# EAGLE design Serial LCD Backpack v28 (EAGLE 5.04)
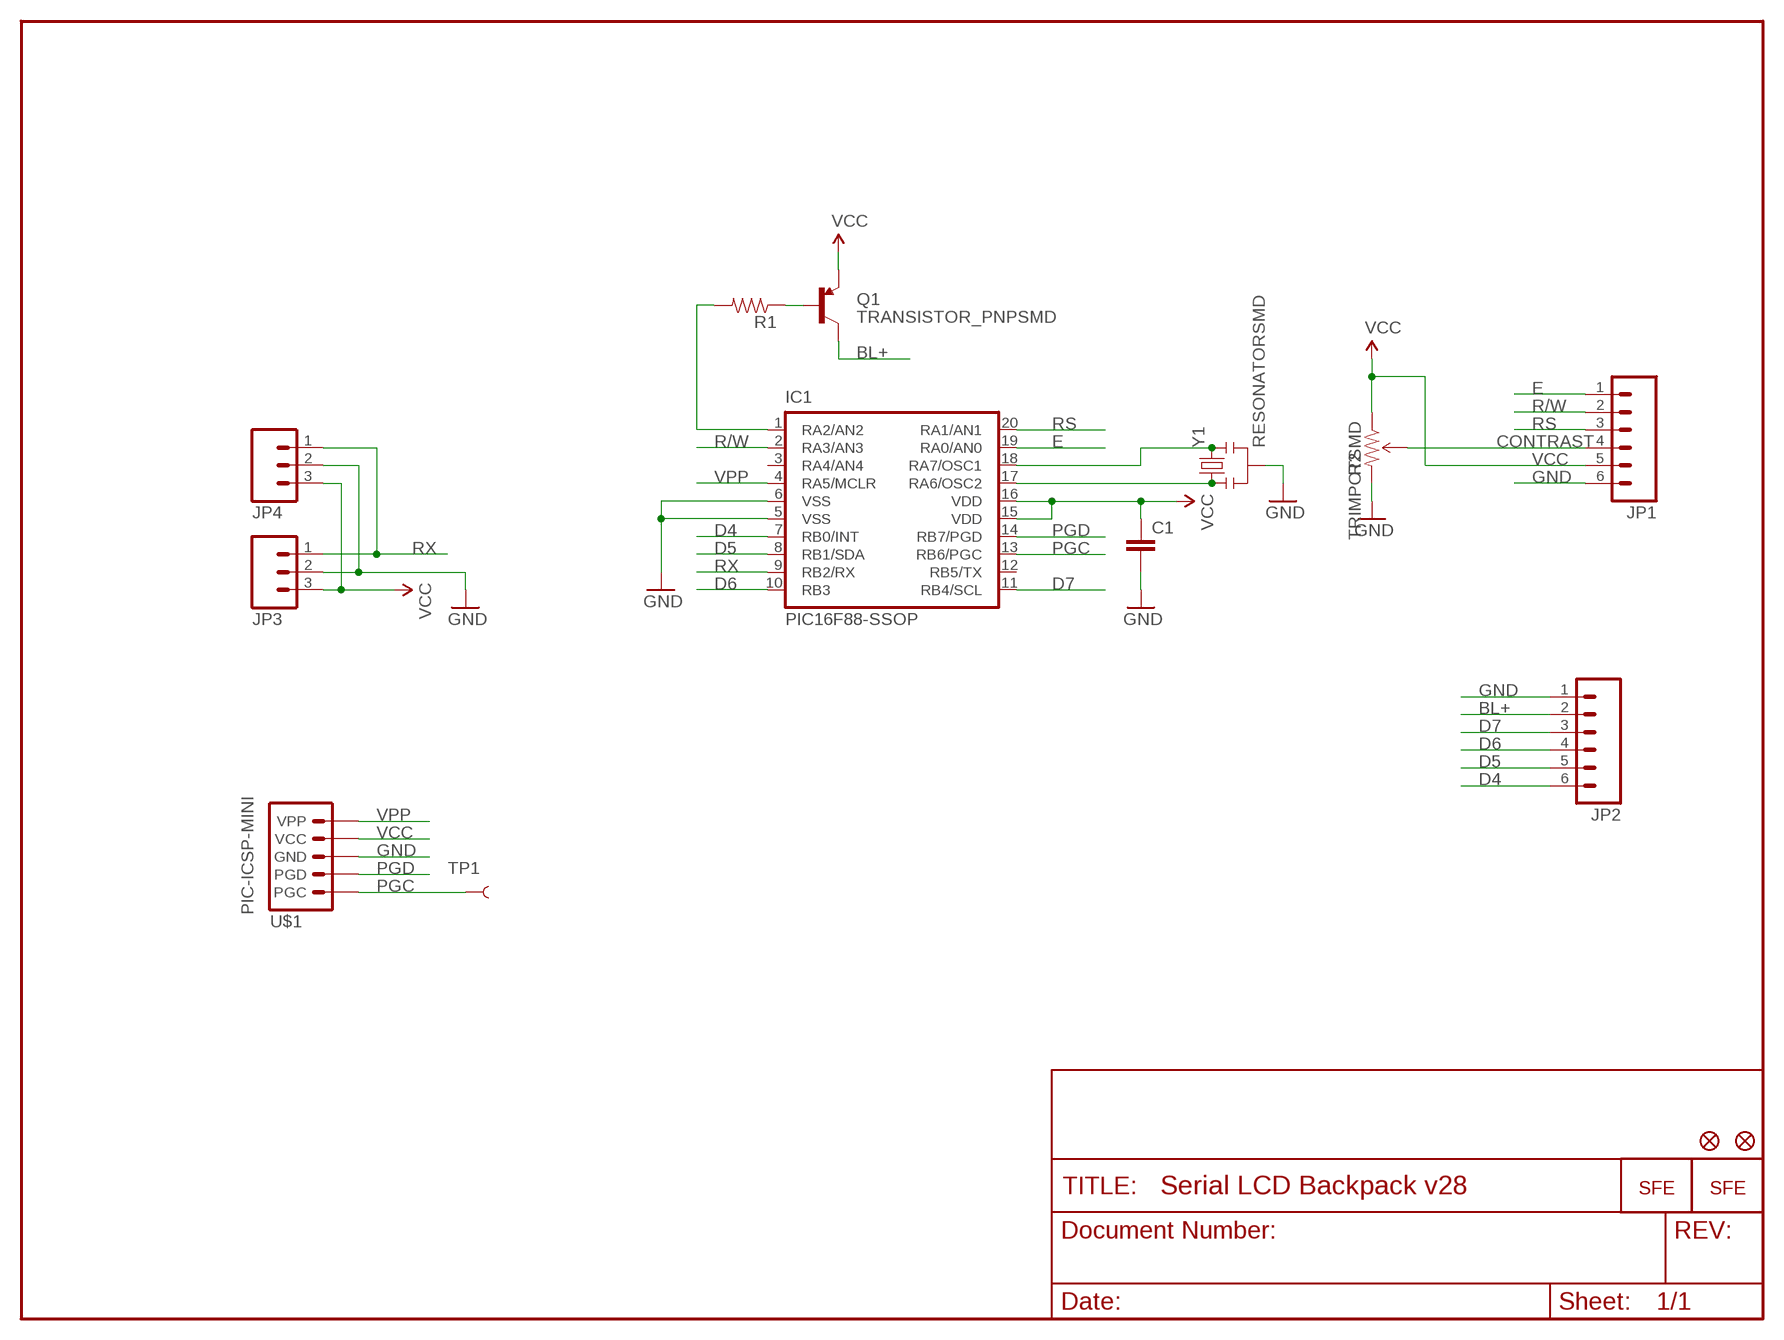
[diagram p0: schematic, sheet 1]

## Parts
C1  CAP0402-CAP  [0402-CAP]
IC1  PIC16F88-SSOP  [SSOP20]
JP1  M06LOCK  [1X06_LOCK]
JP2  M06LOCK  [1X06_LOCK]
JP3  M03PTH  [1X03]
JP4  M03SCREW_LOCK  [SCREWTERMINAL-3.5MM-3_LOCK.007S]
Q1  TRANSISTOR_PNPSMD  [SOT23-3]
R1  RESISTOR0402-RES  [0402-RES]
R2  TRIMPOTSMD  [TRIMPOT-3MM]
TP1  TEST-POINT3X5  [PAD.03X.05]
U$1  PIC-ICSP-MINI  [PIC-ICSP-MINI]
U$2  LOGO-FLAME-LARGE  [LOGO-FLAME-LARGE]
U$3  FIDUCIAL1X2  [FIDUCIAL-1X2]
U$4  FIDUCIAL1X2  [FIDUCIAL-1X2]
U$5  LOGO-SFENEW  [SFE-NEW-WEBLOGO]
Y1  RESONATORSMD  [RESONATOR-SMD]

## Nets
BL+: JP2.2 Q1.3(C)
CONTRAST: JP1.4 R2.2(WIPER)
D4: IC1.7(RB0/INT) JP2.6
D5: IC1.8(RB1/SDA) JP2.5
D6: IC1.10(RB3) JP2.4
D7: IC1.11(RB4/SCL) JP2.3
E: IC1.19(RA0/AN0) JP1.1
GND: C1.2 IC1.5(VSS) IC1.6(VSS) JP1.6 JP2.1 JP3.2 JP4.2 R2.3(CW) U$1.3(GND) Y1.2
N$3: IC1.18(RA7/OSC1) Y1.3
N$4: IC1.17(RA6/OSC2) Y1.1
N$11: IC1.1(RA2/AN2) R1.2
N$13: Q1.1(B) R1.1
PGC: IC1.13(RB6/PGC) TP1.P$1 U$1.5(PGC)
PGD: IC1.14(RB7/PGD) U$1.4(PGD)
R/W: IC1.2(RA3/AN3) JP1.2
RS: IC1.20(RA1/AN1) JP1.3
RX: IC1.9(RB2/RX) JP3.1 JP4.1
VCC: C1.1 IC1.15(VDD) IC1.16(VDD) JP1.5 JP3.3 JP4.3 Q1.2(E) R2.1(CCW) U$1.2(VCC)
VPP: IC1.4(RA5/MCLR) U$1.1(VPP)
Unconnected: IC1.3(RA4/AN4) IC1.12(RB5/TX)

## Library data of the parts
C1 = SparkFun:CAP: Capacitor Standard 0603 ceramic capacitor, and 0.1" leaded capacitor.
IC1 = SparkFun:PIC16F88-SSOP: PIC 16F8x 8-Bit PIC16F8X Family Pin Compatible : PIC16F83, PIC16CR83, PIC16F84A, PIC16CR84
JP1 JP2 = SparkFun:M06: Header 6 Standard 6-pin 0.1" header. Use with straight break away headers (SKU : PRT-00116), right angle break away headers (PRT-00553), swiss pins (PRT-00743), machine pins (PRT-00117), and female headers (PRT-00115). Molex polarized connector foot print use with SKU : PRT-08094 with associated crimp pins and housings. NOTES ON THE VARIANTS LOCK and LOCK_LONGPADS... This footprint was designed to help hold the alignment of a through-hole component (i.e. 6-pin header) while soldering it into place. You may notice that each hole has been shifted either up or down by 0.005 of an inch from it's more standard position (which is a perfectly straight line). This slight alteration caused the pins (the squares in the middle) to touch the edges of the holes. Because they are alternating, it causes a "brace" to hold the component in place. 0.005 has proven to be the perfect amount of "off-center" position when using our standard breakaway headers. Although looks a little odd when you look at the bare footprint, once you have a header in there, the alteration is very hard to notice. Also, if you push a header all the way into place, it is covered up entirely on the bottom side. This idea of altering the position of holes to aid alignment will be further integrated into the Sparkfun Library for other footprints. It can help hold any component with 3 or more connection pins.
JP3 JP4 = SparkFun:M03: Header 3 Standard 3-pin 0.1" header. Use with straight break away headers (SKU : PRT-00116), right angle break away headers (PRT-00553), swiss pins (PRT-00743), machine pins (PRT-00117), and female headers (PRT-00115). Molex polarized connector foot print use with SKU : PRT-08232 with associated crimp pins and housings.
Q1 = SparkFun:TRANSISTOR_PNP
R1 = SparkFun:RESISTOR: Resistor Basic schematic elements and footprints for 0603, 1206, and PTH 1/10th watt (small) resistors.
R2 = SparkFun:TRIMPOT
TP1 = SparkFun:TEST-POINT
U$1 = SparkFun:PIC-ICSP-MINI: PIC-ICSP-Mini Miniature 5-pin connection for temporary programming of PICs. Use this device in your design to save space. Program the PIC with this adapter Spark Fun Electronics SKU : BOB-00194
U$2 = SparkFun:LOGO-FLAME-LARGE
U$3 U$4 = SparkFun:FIDUCIAL: Fiducial Alignment Points Various fiducial points for machine vision alignment.
U$5 = SparkFun:LOGO-SFE: Spark Fun Electronics PCB Logo This is the standard Spark Fun Electronics PCB logo.
Y1 = SparkFun:RESONATOR: Resonator Small SMD resonator. This is the itty bitty 10/20MHz resonators with built in caps. CSTCE10M0G55 and CSTCE20M0V53. Footprint has been reviewed closely but hasn't been tested yet.

## Board
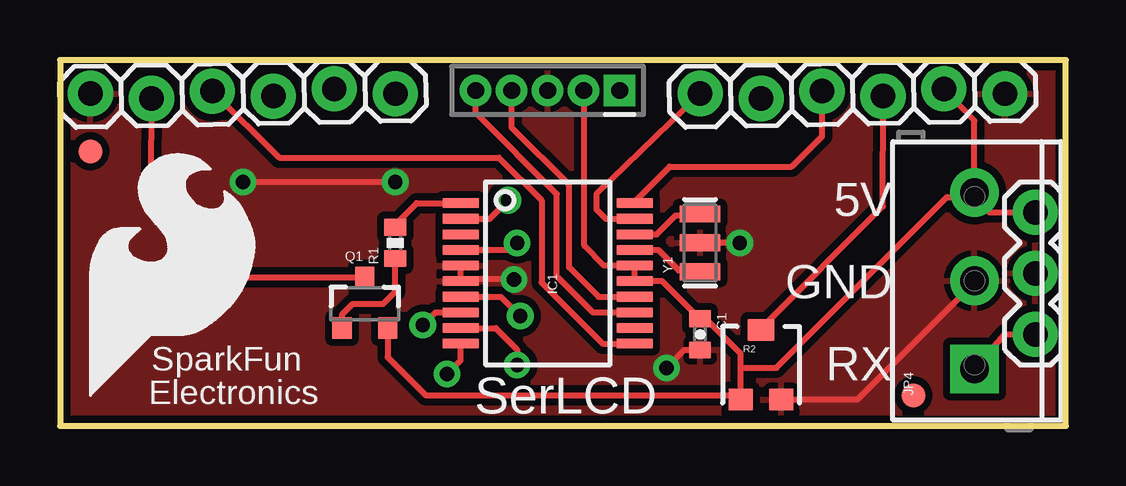
[diagram p1: board, top side]
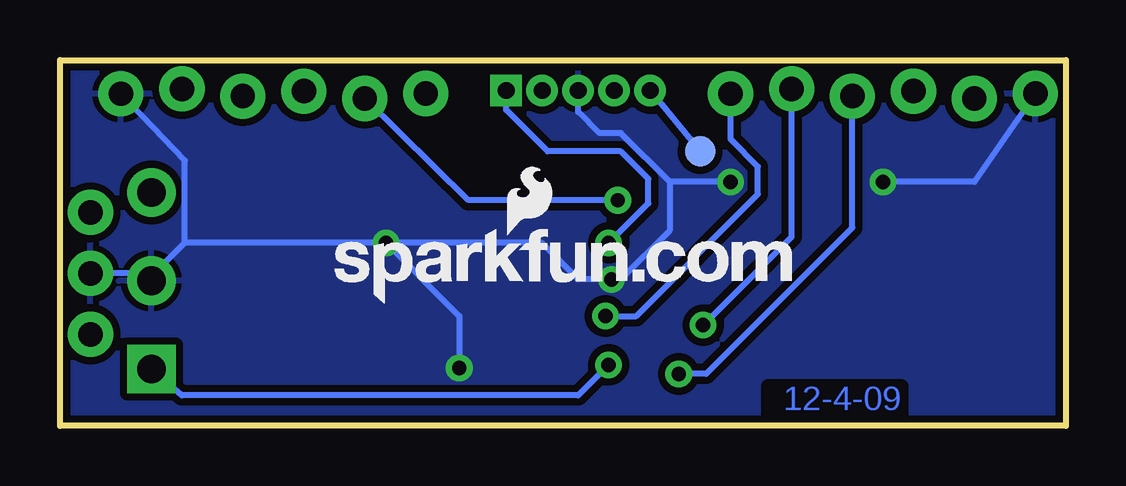
[diagram p2: board, bottom side, seen from below]

Size 41.91 x 15.24 mm. Coordinates in mm from the lower left corner, seen from the top.
Outline: 41.91,0 41.91,15.24 0,15.24 0,0 41.91,0
Copper layers (1*16): Top 0.035mm / dielectric 1.5mm / Bottom 0.035mm
Design rules "SparkFun *": minimum track width 8mil, minimum drill 20mil, track to track 8mil, track to pad 8mil, pad to pad 8mil, via to via 8mil, smd to smd 8mil, copper to edge 10mil, drill to drill 8mil, minimum pad ring 12mil, minimum via ring 10mil, stop-mask expansion 4mil, vias tented up to drill 25mil, thermal gap 10mil

### Footprints (pad centres in the part's own frame; a part is rotated, then mirrored left to right if it is on the bottom)
0402-CAP = smd 0.7 x 0.9: 1 -0.65,0; 2 0.65,0
SSOP20 = smd 0.4 x 1.5: 1 -2.925,-3.625; 2 -2.275,-3.625; 3 -1.625,-3.625; 4 -0.975,-3.625; 5 -0.325,-3.625; 6 0.325,-3.625; 7 0.975,-3.625; 8 1.625,-3.625; 9 2.275,-3.625; 10 2.925,-3.625; 11 2.925,3.625; 12 2.275,3.625; 13 1.625,3.625; 14 0.975,3.625; 15 0.325,3.625; 16 -0.325,3.625; 17 -0.975,3.625; 18 -1.625,3.625; 19 -2.275,3.625; 20 -2.925,3.625
1X06_LOCK = drill 1.016 pad 1.88 round: 1 0,0; 2 2.54,-0.254; 3 5.08,0; 4 7.62,-0.254; 5 10.16,0; 6 12.7,-0.254
1X03 = drill 1.016 pad 1.88 round: 1 0,0; 2 2.54,0; 3 5.08,0
SCREWTERMINAL-3.5MM-3_LOCK.007S = drill 1.2 pad 2.032 square: 1 -0.178,0 | drill 1.2 pad 2.032 round: 2 3.5,0; 3 7.178,0
SOT23-3 = smd 0.8 x 0.9: 1 -0.95,-1; 2 0.95,-1; 3 0,1.1
0402-RES = smd 0.7 x 0.9: 1 -0.65,0; 2 0.65,0
TRIMPOT-3MM = smd 1 x 0.9: 1 -0.85,-1.45; 3 0.85,-1.45 | smd 1.1 x 0.9: 2 0,1.45
PAD.03X.05 = smd 1.27 x 1.27: P$1 0,0
PIC-ICSP-MINI = drill 0.7 square: 1 -3,0 | drill 0.7 round: 2 -1.5,0; 3 0,0; 4 1.5,0; 5 3,0
FIDUCIAL-1X2 = smd 1 x 1: 1 0,0
RESONATOR-SMD = smd 0.7 x 1.7: 1 -1.2,0; 2 0,0; 3 1.2,0

### Placement (x,y rotation side)
C1  26.67,3.81 270 top
IC1  20.32,6.35 270 top
JP1  26.67,13.84 1.1 top
JP2  1.27,13.84 1.1 top
JP3  40.64,3.81 90 top
JP4  38.1,2.54 90 top
Q1  12.7,5.08 0 top
R1  13.97,7.62 90 top
R2  29.21,2.54 0 top
TP1  15.24,11.43 0 bottom
U$1  20.32,13.97 180 top
U$2  1.27,1.27 0 top
U$3  1.27,11.43 90 top
U$4  35.56,1.27 90 top
U$5  30.48,5.08 0 bottom
Y1  26.67,7.62 90 top

### Tracks (layer width: path | path; a pad name or v marks a point on that pad's centre or on a via)
BL+
  Top 0.254: Q1.3 7.79,6.18 3.81,10.16 JP2.2
CONTRAST
  Top 0.254: 29.21,3.81 R2.2 29.21,4.06 34.29,9.14 JP1.4
D4  (via drill 0.6)
  Top 0.254: IC1.7 18.37,5.38 v19.18,4.57
  Bottom 0.254: JP2.6 13.97,11.94 12.83,10.79 12.83,9.65 17.91,4.57 v19.18,4.57
D5  (via drill 0.6)
  Top 0.254: IC1.8 15.65,4.72 v15.11,4.19
  Bottom 0.254: v15.11,4.19 11.43,7.87 JP2.5
D6  (via drill 0.6)
  Top 0.254: IC1.10 16.7,2.73 v16.13,2.16
  Bottom 0.254: JP2.4 8.89,8.26 14.99,2.16 v16.13,2.16
D7
  Top 0.254: IC1.11 22.61,3.42 20.07,5.97 20.07,9.4 18.29,11.18 9.14,11.18 JP2.3
E
  Top 0.254: IC1.19 22.74,8.62 22.35,9.02 22.35,9.65 JP1.1
GND  (via drill 0.6)
  Top 0.254: IC1.6 16.76,5.97 | IC1.6 16.76,6.1 v18.92,6.1 | IC1.5 16.7,6.04 IC1.6 | v28.32,7.62 Y1.2 | C1.2 26.02,3.16 v25.27,2.41 | v7.62,10.16 v13.97,10.16 | JP4.2 38.1,5.97 33.22,1.09 R2.3
  Bottom 0.254: 16.51,10.16 16.51,8.13 18.54,6.1 v18.92,6.1 20.32,6.1 21.84,7.62 v28.32,7.62 | v25.27,2.41 25.27,4.57 v28.32,7.62 | JP3.2 38.35,6.35 38.1,6.1 JP4.2 38.1,6.22 36.7,7.62 | v28.32,7.62 36.7,7.62 | JP2.1 3.81,10.16 v7.62,10.16 | v13.97,10.16 16.51,10.16 | U$1.3 20.32,13.08 19.43,12.19 18.54,12.19 16.51,10.16 | JP1.6 36.7,11.05 36.7,7.62
  pour Bottom (isolate 0.305): 0,0 41.91,0 41.91,15.24 0,15.24
  pour Top (isolate 0.305): 0,0 41.91,0 41.91,15.24 0,15.24
N$3
  Top 0.254: IC1.18 24.87,7.97 25.65,8.76 26.67,8.76 Y1.3
N$4
  Top 0.254: IC1.17 24.93,7.33 25.78,6.48 26.67,6.48 26.73,6.42 | 26.73,6.42 26.8,6.35 | 26.73,6.42 Y1.1
N$11
  Top 0.254: R1.2 13.97,8.38 14.86,9.28 IC1.1
N$13
  Top 0.254: Q1.1 11.75,4.64 12.19,5.08 13.46,5.08 13.97,5.59 R1.1 13.97,6.99
PGC
  Top 0.254: IC1.13 22.2,4.72 20.7,6.22 20.7,9.65 17.32,13.03 U$1.5
  Bottom 0.254: U$1.5 TP1.P$1
PGD
  Top 0.254: IC1.14 22.44,5.38 21.21,6.6 21.21,10.03 18.82,12.42 U$1.4
R/W  (via drill 0.6)
  Top 0.254: IC1.2 17.9,8.62 v18.67,9.4
  Bottom 0.254: JP1.2 24.89,9.4 v18.67,9.4
RS
  Top 0.254: IC1.20 23.95,9.34 25.4,10.79 30.48,10.79 31.75,12.06 JP1.3
RX  (via drill 0.6)
  Top 0.254: JP3.1 39.37,3.81 JP4.1 | v19.05,2.54 19.05,3.17 18.16,4.06 16.76,4.06 16.75,4.08 IC1.9
  Bottom 0.254: JP4.1 36.83,1.27 20.32,1.27 v19.05,2.54
VCC
  Top 0.254: 26.67,4.45 25.09,6.03 IC1.15 23.95,6.04 24,6.1 23.95,6.15 IC1.16 22.66,6.67 21.84,7.49 21.84,13.97 U$1.2 | R2.1 28.36,3.01 26.92,4.45 26.67,4.45 | 26.67,4.45 C1.1 | JP3.3 38.73,8.89 38.1,9.53 | R2.1 28.36,2.33 28.45,2.41 29.84,2.41 36.96,9.53 38.1,9.53 | 38.1,9.53 JP4.3 38.1,12.7 JP1.5 | Q1.2 13.65,2.86 15.24,1.27 28.19,1.27 28.36,1.1 R2.1
VPP  (via drill 0.6)
  Top 0.254: IC1.4 18.75,7.33 v19.05,7.62
  Bottom 0.254: v19.05,7.62 17.4,9.27 17.4,10.29 18.54,11.43 21.59,11.43 23.32,13.16 U$1.1

### Text on the board
Bottom: 12-4-09
tPlace: 5V | GND | RX | SparkFun | Electronics | SerLCD